# Altium schematic sheet 1_Power.SchDoc
size A4; SheetNumber: 1; SheetTotal: 2
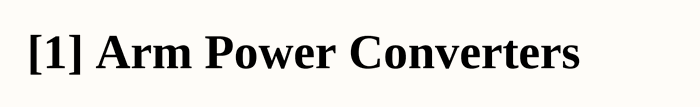
[diagram p0: 1_Power.SchDoc]

## Notes on the sheet
- [1] Arm Power Converters